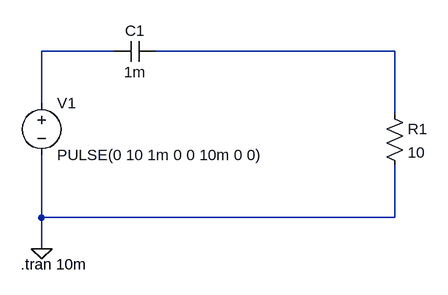
[diagram p0: schematic rc.asc]
rc.asc, the LTspice schematic file:
Version 4.1
SHEET 1 880 680
WIRE 64 64 -48 64
WIRE 496 64 128 64
WIRE -48 144 -48 64
WIRE 496 160 496 64
WIRE -48 320 -48 224
WIRE 496 320 496 240
WIRE 496 320 -48 320
WIRE -48 368 -48 320
FLAG -48 368 0
SYMBOL voltage -48 128 R0
WINDOW 123 0 0 Left 0
WINDOW 39 0 0 Left 0
SYMATTR InstName V1
SYMATTR Value PULSE(0 10 1m 0 0 10m 0 0)
SYMBOL res 480 144 R0
SYMATTR InstName R1
SYMATTR Value 10
SYMBOL cap 128 48 R90
WINDOW 0 0 32 VBottom 2
WINDOW 3 32 32 VTop 2
SYMATTR InstName C1
SYMATTR Value 1m
TEXT -80 392 Left 2 !.tran 10m

The netlist it stands for:
* rc.asc
V1 N001 0 PULSE(0 10 1m 0 0 10m 0 0)
R1 N002 0 10
C1 N002 N001 1m
.tran 10m
.backanno
.end